# EAGLE schematic IRtestCircuit (EAGLE 9.4.0)
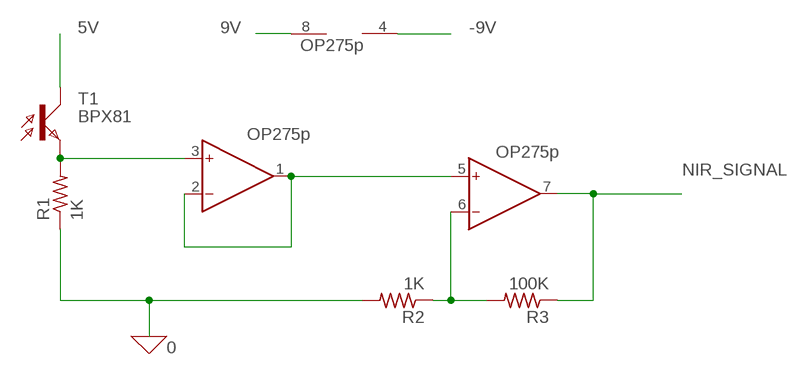
[diagram p0: schematic, sheet 1]

## Parts
IC1  OP275p  AD746N  [DIL08]
R1  1K  R-US_0207/10  [0207/10]
R2  1K  R-US_0207/10  [0207/10]
R3  100K  R-US_0207/10  [0207/10]
T1  BPX81  [BPX81]

## Nets
0: R1.1 R2.2 ; supply symbol labelled GND
5V: T1.C
9V: IC1.8(P:V+)
-9V: IC1.4(P:V-)
N$1: IC1.3(A:IN+) R1.2 T1.E
N$2: IC1.1(A:OUT) IC1.2(A:IN-) IC1.5(B:IN+)
N$4: IC1.6(B:IN-) R2.1 R3.2
NIR_SIGNAL: IC1.7(B:OUT) R3.1

## Library data of the parts
IC1 = analog-devices:AD746: Dual Precision, 500 ns Settling, BiFET Op Amp Source: http://www.analog.com/static/imported-files/data_sheets/AD746.pdf; MF: ALTERA CORPORATION; MPN: AD746JNZ; OC_FARNELL: 1438363; OC_NEWARK: 59K4844
R1-R3 = rcl:R-US_: RESISTOR, American symbol; SPICEPREFIX: R
T1 = opto-trans-siemens:BPX81: PHOTO TRANSISTOR; OC_FARNELL: unknown; OC_NEWARK: unknown